# EAGLE schematic tetris_mega (EAGLE 6.2)
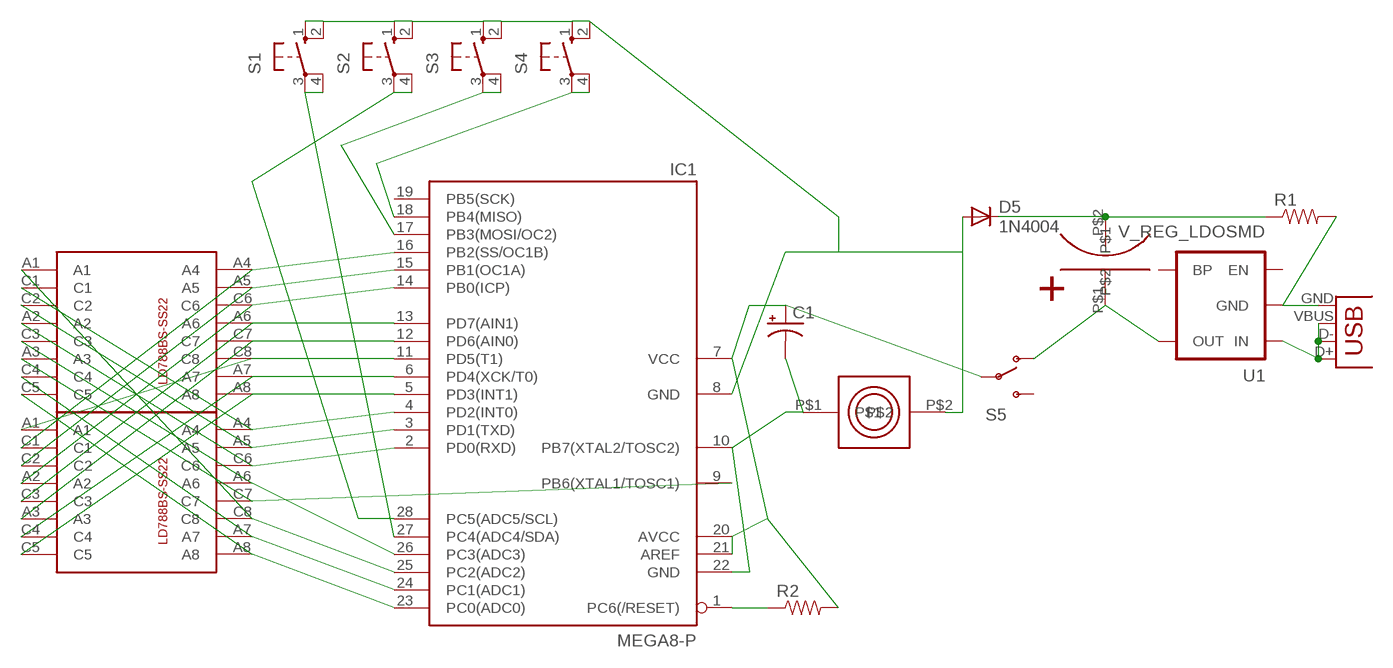
[diagram p0: schematic, sheet 1]

## Parts
C1  CAP_POLPTH1  [CPOL-RADIAL-100UF-25V]
D5  1N4004  [DO41-10]
IC1  MEGA8-P  [DIL28-3]
R1  RESISTORPTH1  [AXIAL-0.3]
R2  RESISTORPTH1  [AXIAL-0.3]
S1  10-XX  [B3F-10XX]
S2  10-XX  [B3F-10XX]
S3  10-XX  [B3F-10XX]
S4  10-XX  [B3F-10XX]
S5  SWITCH-SPSTSMD2  [SWITCH-SPDT-SMD]
U1  V_REG_LDOSMD  [SOT23-5]
U$1  LD788BS-SS22  [LD788BS-SS22]
U$2  LD788BS-SS22  [LD788BS-SS22]
U$4  I-80450RF  [ISK4.1K_I-80450RF_I2G]
U$5  NICHICON_12F  [NICHICON_10X30]
X1  USB-MICROB  [USB-MICROB]

## Nets
N$1: IC1.4(PD2(INT0)) U$1.A4 U$2.C1
N$2: IC1.3(PD1(TXD)) U$1.A5 U$2.C2
N$3: IC1.2(PD0(RXD)) U$1.C6 U$2.A2
N$4: IC1.26(PC3(ADC3)) U$1.A6 U$2.C3
N$5: IC1.9(PB6(XTAL1/TOSC1)) U$1.C7 U$2.A3
N$6: IC1.24(PC1(ADC1)) U$1.A7 U$2.C4
N$7: IC1.23(PC0(ADC0)) U$1.A8 U$2.C5
N$8: IC1.25(PC2(ADC2)) U$1.C8 U$2.A1
N$9: D5.C R1.P$1 U$5.P$2
N$10: IC1.15(PB1(OC1A)) U$1.C2 U$2.A5
N$11: IC1.14(PB0(ICP)) U$1.A2 U$2.C6
N$12: IC1.13(PD7(AIN1)) U$1.C3 U$2.A6
N$13: IC1.12(PD6(AIN0)) U$1.A3 U$2.C7
N$14: IC1.11(PD5(T1)) U$1.A1 U$2.C8
N$15: IC1.6(PD4(XCK/T0)) U$1.C4 U$2.A7
N$16: IC1.5(PD3(INT1)) U$1.C5 U$2.A8
N$17: C1.2(-) IC1.10(PB7(XTAL2/TOSC2)) IC1.22(GND) U$4.P$1
N$19: S5.1(O) U1.5(OUT) U$5.P$1
N$20: IC1.27(PC4(ADC4/SDA)) S1.3(P) S1.4(P1)
N$21: IC1.28(PC5(ADC5/SCL)) S2.3(P) S2.4(P1)
N$22: IC1.17(PB3(MOSI/OC2)) S3.3(P) S3.4(P1)
N$23: IC1.18(PB4(MISO)) S4.3(P) S4.4(P1)
N$24: R1.P$2 U1.2(GND) X1.GND
N$25: U1.1(IN) X1.D+ X1.D- X1.VBUS
N$26: C1.1(+) IC1.7(VCC) IC1.20(AVCC) IC1.21(AREF) R2.P$2 S5.2(P)
N$27: D5.A IC1.8(GND) S1.1(S) S1.2(S1) S2.1(S) S2.2(S1) S3.1(S) S3.2(S1) S4.1(S) S4.2(S1) U$4.P$2
N$28: IC1.16(PB2(SS/OC1B)) U$1.C1 U$2.A4
N$29: IC1.1(PC6(/RESET)) R2.P$1
Unconnected: IC1.19(PB5(SCK)) S5.3(S) U1.3(EN) U1.4(BP)

## Library data of the parts
C1 = SparkFun:CAP_POL: Capacitor Polarized These are standard SMD and PTH capacitors. Normally 10uF, 47uF, and 100uF in electrolytic and tantalum varieties. Always verify the external diameter of the through hole cap, it varies with capacity, voltage, and manufacturer. The EIA devices should be standard.
D5 = adafruit:1N4004: DIODE General purpose 1N400x type rectifier (With bigger pads) http://www.ladyada.net/library/pcb/eaglelibrary.html
IC1 = atmel:MEGA8-P: MICROCONTROLLER 8 Kbytes FLASH, 1 kbytes SRAM, 512 bytes EEPROM, USART, 4-channel 10 bit ADC, 2-channel 8 bit ADC Pin compatible with Atmega48, ATMega88, ATMega168 Source: avr.lbr; OC_FARNELL: unknown; OC_NEWARK: unknown
R1 R2 = SparkFun:RESISTOR: Resistor Basic schematic elements and footprints for 0603, 1206, and PTH 1/10th watt (small) resistors.
S1-S4 = switch-omron:10-XX: OMRON SWITCH; MPN: B3F-1000; OC_FARNELL: 176432; OC_NEWARK: 36M3542
S5 = SparkFun:SWITCH-SPST: SPST Switch Simple slide switch. Spark Fun Electronics SKU : COM-00102
U1 = SparkFun:V_REG_LDO: Voltage Regulator LDO Standard 150mA LDO voltage regulator in SOT-23 layout. Micrel part MIC5205. BP (by-pass) pin is used to lower output noise with 470pF cap.
U$1 U$2 = mrule:LD788BS-SS22
U$4 = mrule:I-80450RF
U$5 = mrule:NICHICON_12F
X1 = SparkFun:USB: USB Connectors USB-B-PTH is fully proven SKU : PRT-00139 USB-miniB is fully proven SKU : PRT-00587 USB-A-PCB is untested. USB-A-H is throughly reviewed, but untested. Spark Fun Electronics SKU : PRT-00437 USB-B-SMT is throughly reviewed, but untested. Needs silkscreen touching up. USB-A-S has not been used/tested USB-MB-H has not been used/tested